# EAGLE design BusBlasterv4.1a (EAGLE 5.07)
LEFT: Normal; OFF: Self-Pwr 1.5~3.3V; ON: Bus-Pwr 3.3V; RIGHT: Update Buffer
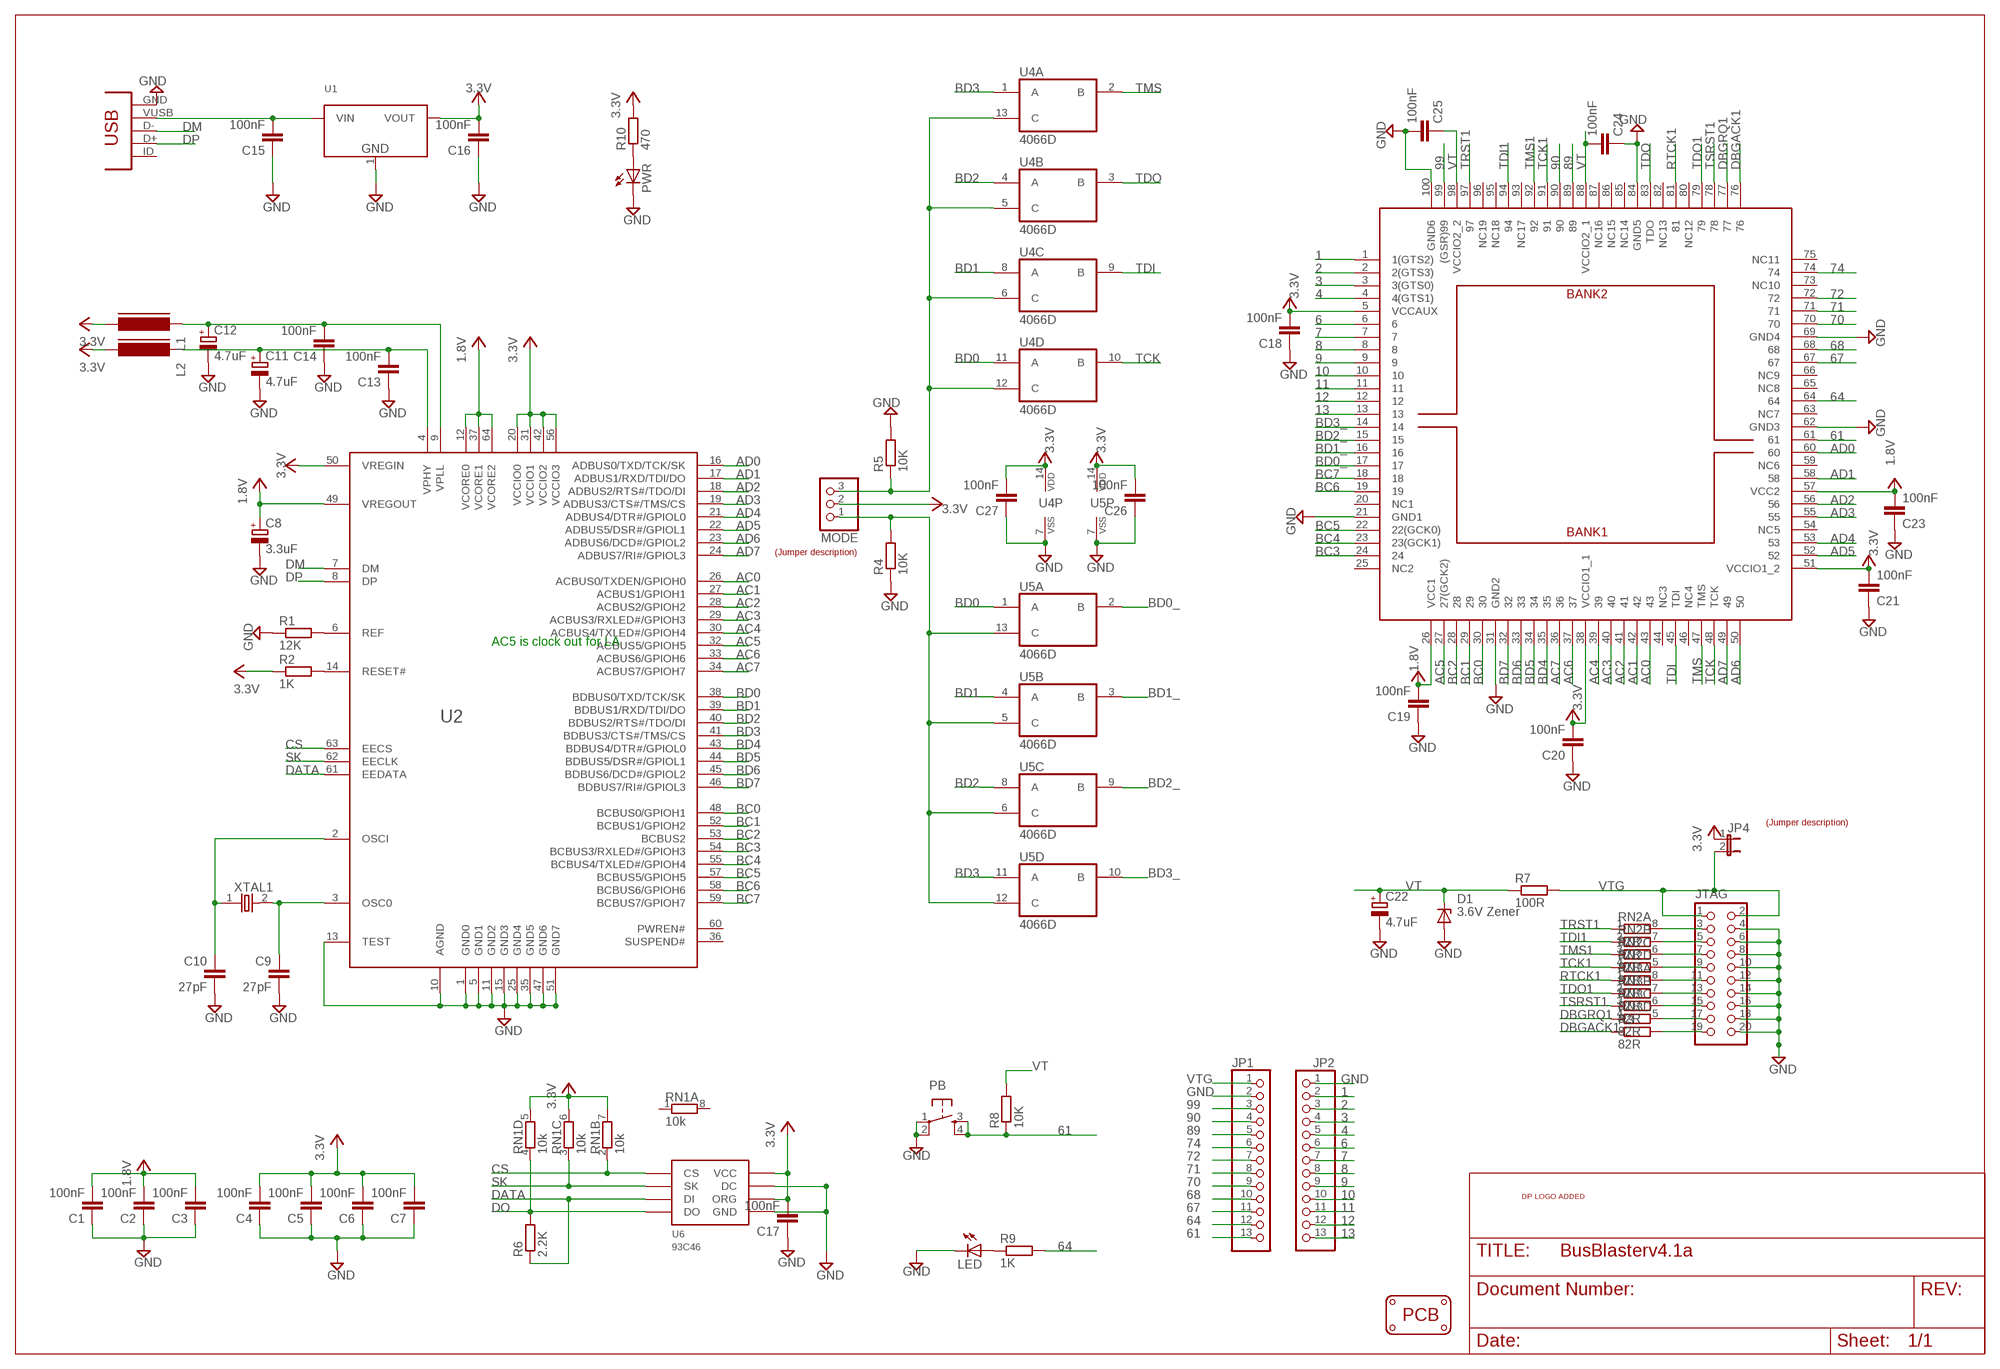
[diagram p0: schematic, sheet 1]

## Parts
C1  100nF  CAPC603  [C603]
C2  100nF  CAPC603  [C603]
C3  100nF  CAPC603  [C603]
C4  100nF  CAPC603  [C603]
C5  100nF  CAPC603  [C603]
C6  100nF  CAPC603  [C603]
C7  100nF  CAPC603  [C603]
C8  3.3uF  CAP_POLSMC_A  [SMC_A]
C9  27pF  CAPC603  [C603]
C10  27pF  CAPC603  [C603]
C11  4.7uF  CAP_POLSMC_A  [SMC_A]
C12  4.7uF  CAP_POLSMC_A  [SMC_A]
C13  100nF  CAPC603  [C603]
C14  100nF  CAPC603  [C603]
C15  100nF  CAPC603  [C603]
C16  100nF  CAPC603  [C603]
C17  100nF  CAPC603  [C603]
C18  100nF  CAPC603  [C603]
C19  100nF  CAPC603  [C603]
C20  100nF  CAPC603  [C603]
C21  100nF  CAPC603  [C603]
C22  4.7uF  CAP_POLSMC_A  [SMC_A]
C23  100nF  CAPC603  [C603]
C24  100nF  CAPC603  [C603]
C25  100nF  CAPC603  [C603]
C26  100nF  CAPC603  [C603]
C27  100nF  CAPC603  [C603]
D1  3.6V Zener  ZENERSOD-123  [SOD-123]
JP1  PINHD-1X13  [1X13]
JP2  PINHD-1X13  [1X13]
JP4  JP1EJP  [1X02]
JTAG  CON_HEADER_2X10-SHROUDED  [PINSHRD_PTH_2X10]
L1  FERRITE_BEAD603  [FB603]
L2  FERRITE_BEAD603  [FB603]
LED  LED805  [LED-805]
MODE  PINHD-1X3  [1X03]
PB  SW-SMD-SMALL  [TACT_SWITCH_SMALL]
PCB1  PCB_DP_RECTANGLE-56X90  [DP9056_V1]
PWR  LEDCHIPLED_0805  [CHIPLED_0805]
R1  12K  RESISTORR603  [R603]
R2  1K  RESISTORR603  [R603]
R3  82R  RESISTORR603  [R603]
R4  10K  RESISTORR603  [R603]
R5  10K  RESISTORR603  [R603]
R6  2.2K  RESISTORR603  [R603]
R7  100R  RESISTORR1206  [R1206]
R8  10K  RESISTORR603  [R603]
R9  1K  RESISTORR603  [R603]
R10  470  RESISTORR603  [R603]
RN1  10k  RNETWORK  [RN8P-4R-CRA06S]
RN2  82R  RNETWORK  [RN8P-4R-CRA06S]
RN3  82R  RNETWORK  [RN8P-4R-CRA06S]
U1  LD1117-3.3SOT223  [SOT223]
U2  FT2232H  [LQFP64@1]
U3  XC2C64A  [VQ100]
U4  4066D  [SO14]
U5  4066D  [SO14]
U6  93C46  [SOIC8]
U$1  DP_LOGO1.5X1.5  [DP_LOGO_ART_1.5X1.5]
U$4  LABEL_JUMPER_1X3  [JUMP3_DESC]
U$7  LABEL_JUMPER_1X2  [JUMP2_DESC]
USB  CON-USB-MINI-BUSB1  [CONN_USB_MINI-B]
XTAL1  OSC-XTAL  [HC-49U]

## Nets
1: JP2.2 U3.1(1(GTS2))
1.8V: C1.2 C2.2 C3.2 C8.+ C19.2 C23.2 U2.12(VCORE0) U2.37(VCORE1) U2.49(VREGOUT) U2.64(VCORE2) U3.26(VCC1) U3.57(VCC2)
2: JP2.3 U3.2(2(GTS3))
3: JP2.4 U3.3(3(GTS0))
4: JP2.5 U3.4(4(GTS1))
6: JP2.6 U3.6
7: JP2.7 U3.7
8: JP2.8 U3.8
9: JP2.9 U3.9
10: JP2.10 U3.10
11: JP2.11 U3.11
12: JP2.12 U3.12
13: JP2.13 U3.13
61: JP1.13 PB.3 PB.4 R8.1 U3.61
64: JP1.12 R9.2 U3.64
67: JP1.11 U3.67
68: JP1.10 U3.68
70: JP1.9 U3.70
71: JP1.8 U3.71
72: JP1.7 U3.72
74: JP1.6 U3.74
89: JP1.5 U3.89
90: JP1.4 U3.90
99: JP1.3 U3.99((GSR)99)
+3V3: C4.2 C5.2 C6.2 C7.2 C16.2 C17.2 C18.2 C20.2 C21.2 C26.2 C27.2 JP4.1 L1.2 L2.2 MODE.2 R2.1 R10.2 RN1.5 RN1.6 RN1.7 U1.2(VOUT) U2.20(VCCIO0) U2.31(VCCIO1) U2.42(VCCIO2) U2.50(VREGIN) U2.56(VCCIO3) U3.5(VCCAUX) U3.38(VCCIO1_1) U3.51(VCCIO1_2) U4.14(P:VDD) U5.14(P:VDD) U6.6(ORG) U6.8(VCC) ; supply symbol labelled 3.3V
AC0: U2.26(ACBUS0/TXDEN/GPIOH0) U3.43
AC1: U2.27(ACBUS1/GPIOH1) U3.42
AC2: U2.28(ACBUS2/GPIOH2) U3.41
AC3: U2.29(ACBUS3/RXLED#/GPIOH3) U3.40
AC4: U2.30(ACBUS4/TXLED#/GPIOH4) U3.39
AC5: U2.32(ACBUS5/GPIOH5) U3.27(27(GCK2))
AC6: U2.33(ACBUS6/GPIOH6) U3.37
AC7: U2.34(ACBUS7/GPIOH7) U3.36
AD0: U2.16(ADBUS0/TXD/TCK/SK) U3.60
AD1: U2.17(ADBUS1/RXD/TDI/DO) U3.58
AD2: U2.18(ADBUS2/RTS#/TDO/DI) U3.56
AD3: U2.19(ADBUS3/CTS#/TMS/CS) U3.55
AD4: U2.21(ADBUS4/DTR#/GPIOL0) U3.53
AD5: U2.22(ADBUS5/DSR#/GPIOL1) U3.52
AD6: U2.23(ADBUS6/DCD#/GPIOL2) U3.50
AD7: U2.24(ADBUS7/RI#/GPIOL3) U3.49
BC0: U2.48(BCBUS0/GPIOH1) U3.30
BC1: U2.52(BCBUS1/GPIOH2) U3.29
BC2: U2.53(BCBUS2) U3.28
BC3: U2.54(BCBUS3/RXLED#/GPIOH3) U3.24
BC4: U2.55(BCBUS4/TXLED#/GPIOH4) U3.23(23(GCK1))
BC5: U2.57(BCBUS5/GPIOH5) U3.22(22(GCK0))
BC6: U2.58(BCBUS6/GPIOH6) U3.19
BC7: U2.59(BCBUS7/GPIOH7) U3.18
BD0: U2.38(BDBUS0/TXD/TCK/SK) U4.11(D:A) U5.1(A:A)
BD0_: U3.17 U5.2(A:B)
BD1: U2.39(BDBUS1/RXD/TDI/DO) U4.8(C:A) U5.4(B:A)
BD1_: U3.16 U5.3(B:B)
BD2: U2.40(BDBUS2/RTS#/TDO/DI) U4.4(B:A) U5.8(C:A)
BD2_: U3.15 U5.9(C:B)
BD3: U2.41(BDBUS3/CTS#/TMS/CS) U4.1(A:A) U5.11(D:A)
BD3_: U3.14 U5.10(D:B)
BD4: U2.43(BDBUS4/DTR#/GPIOL0) U3.35
BD5: U2.44(BDBUS5/DSR#/GPIOL1) U3.34
BD6: U2.45(BDBUS6/DCD#/GPIOL2) U3.33
BD7: U2.46(BDBUS7/RI#/GPIOL3) U3.32
CS: RN1.2 U2.63(EECS) U6.1(CS)
DATA: R6.1 U2.61(EEDATA) U6.3(DI)
DBGACK1: R3.1 U3.76
DBGRQ1: RN3.4 U3.77
DM: U2.7(DM) USB.D-
DO: R6.2 RN1.4 U6.4(DO)
DP: U2.8(DP) USB.D+
GND: C1.1 C2.1 C3.1 C4.1 C5.1 C6.1 C7.1 C8.- C9.2 C10.2 C11.- C12.- C13.1 C14.1 C15.1 C16.1 C17.1 C18.1 C19.1 C20.1 C21.1 C22.- C23.1 C24.1 C25.2 C26.1 C27.1 D1.A JP1.2 JP2.1 JTAG.4 JTAG.6 JTAG.8 JTAG.10 JTAG.12 JTAG.14 JTAG.16 JTAG.18 JTAG.20 LED.C PB.1 PB.2 PWR.C R1.1 R4.1 R5.2 U1.1(GND) U2.1(GND0) U2.5(GND1) U2.10(AGND) U2.11(GND2) U2.13(TEST) U2.15(GND3) U2.25(GND4) U2.35(GND5) U2.47(GND6) U2.51(GND7) U3.21(GND1) U3.31(GND2) U3.62(GND3) U3.69(GND4) U3.84(GND5) U3.100(GND6) U4.7(P:VSS) U5.7(P:VSS) U6.5(GND) U6.7(DC) USB.GND
N$1: C9.1 U2.3(OSC0) XTAL1.2
N$2: C10.1 U2.2(OSCI) XTAL1.1
N$3: R2.2 U2.14(RESET#)
N$4: R1.2 U2.6(REF)
N$5: C15.2 U1.3(VIN) USB.VUSB
N$6: PWR.A R10.1
N$8: LED.A R9.1
N$12: JTAG.3 RN2.8
N$27: JTAG.5 RN2.7
N$28: JTAG.7 RN2.6
N$32: JTAG.9 RN2.5
N$33: JTAG.11 RN3.8
N$38: JTAG.13 RN3.7
N$45: JTAG.15 RN3.6
N$52: JTAG.17 RN3.5
N$64: JTAG.19 R3.2
N$72: MODE.3 R5.1 U4.5(B:C) U4.6(C:C) U4.12(D:C) U4.13(A:C)
N$73: MODE.1 R4.2 U5.5(B:C) U5.6(C:C) U5.12(D:C) U5.13(A:C)
RTCK1: RN3.1 U3.81
SK: RN1.3 U2.62(EECLK) U6.2(SK)
TCK: U3.48(TCK) U4.10(D:B)
TCK1: RN2.4 U3.91
TDI: U3.45(TDI) U4.9(C:B)
TDI1: RN2.2 U3.94
TDO: U3.83(TDO) U4.3(B:B)
TDO1: RN3.2 U3.79
TMS: U3.47(TMS) U4.2(A:B)
TMS1: RN2.3 U3.92
TRST1: RN2.1 U3.97
TSRST1: RN3.3 U3.78
VPHY: C11.+ C13.2 L2.1 U2.4(VPHY)
VPLL: C12.+ C14.2 L1.1 U2.9(VPLL)
VT: C22.+ C24.2 C25.1 D1.C R7.1 R8.2 U3.88(VCCIO2_1) U3.98(VCCIO2_2)
VTG: JP1.1 JP4.2 JTAG.1 JTAG.2 R7.2
Unconnected: RN1.1 RN1.8 U2.36(SUSPEND#) U2.60(PWREN#) U3.20(NC1) U3.25(NC2) U3.44(NC3) U3.46(NC4) U3.54(NC5) U3.59(NC6) U3.63(NC7) U3.65(NC8) U3.66(NC9) U3.73(NC10) U3.75(NC11) U3.80(NC12) U3.82(NC13) U3.85(NC14) U3.86(NC15) U3.87(NC16) U3.93(NC17) U3.95(NC18) U3.96(NC19) USB.BODY@1(BODY) USB.BODY@2(BODY) USB.BODY@3(BODY) USB.BODY@4(BODY) USB.ID(USBID)

## Notes on the sheet
- AC5 is clock out for LA

## Library data of the parts
C1-C7 C9 C10 C13-C21 C23-C27 = dp_devices:CAP
C8 C11 C12 C22 = DP-EagleLibrary:CAP_POL
D1 = dp_devices:ZENER: Zener Diode SOD-323
JP1 JP2 = pinhead:PINHD-1X13: PIN HEADER
JP4 = jumper:JP1E: JUMPER
JTAG = dp_devices:CON_HEADER_2X10
L1 L2 = dp_devices:FERRITE_BEAD
LED = dp_devices:LED
MODE = pinhead:PINHD-1X3: PIN HEADER
PB = dp_devices:SW-SMD-SMALL
PCB1 = dp_devices:PCB_DP_RECTANGLE: Dangerous Prototypes Standard Rectangular PCB sizes
PWR = led:LED: LED OSRAM: - CHIPLED LG R971, LG N971, LY N971, LG Q971, LY Q971, LO R971, LY R971 LH N974, LH R974 LS Q976, LO Q976, LY Q976 LO Q996 - Hyper CHIPLED LW Q18S LB Q993, LB Q99A, LB R99A - SideLED LS A670, LO A670, LY A670, LG A670, LP A670 LB A673, LV A673, LT A673, LW A673 LH A674 LY A675 LS A676, LA A676, LO A676, LY A676, LW A676 LS A679, LY A679, LG A679 - Hyper Micro SIDELED® LS Y876, LA Y876, LO Y876, LY Y876 LT Y87S - SmartLED LW L88C, LW L88S LB L89C, LB L89S, LG L890 LS L89K, LO L89K, LY L89K LS L896, LA L896, LO L896, LY L896 - TOPLED LS T670, LO T670, LY T670, LG T670, LP T670 LSG T670, LSP T670, LSY T670, LOP T670, LYG T670 LG T671, LOG T671, LSG T671 LB T673, LV T673, LT T673, LW T673 LH T674 LS T676, LA T676, LO T676, LY T676, LB T676, LH T676, LSB T676, LW T676 LB T67C, LV T67C, LT T67C, LS T67K, LO T67K, LY T67K, LW E67C LS E67B, LA E67B, LO E67B, LY E67B, LB E67C, LV E67C, LT E67C LW T67C LS T679, LY T679, LG T679 LS T770, LO T770, LY T770, LG T770, LP T770 LB T773, LV T773, LT T773, LW T773 LH T774 LS E675, LA E675, LY E675, LS T675 LS T776, LA T776, LO T776, LY T776, LB T776 LHGB T686 LT T68C, LB T68C - Hyper Mini TOPLED® LB M676 - Mini TOPLED Santana® LG M470 LS M47K, LO M47K, LY M47K Source: http://www.osram.convergy.de LUXEON: - LUMILED® LXK2-PW12-R00, LXK2-PW12-S00, LXK2-PW14-U00, LXK2-PW14-V00 LXK2-PM12-R00, LXK2-PM12-S00, LXK2-PM14-U00 LXK2-PE12-Q00, LXK2-PE12-R00, LXK2-PE12-S00, LXK2-PE14-T00, LXK2-PE14-U00 LXK2-PB12-K00, LXK2-PB12-L00, LXK2-PB12-M00, LXK2-PB14-N00, LXK2-PB14-P00, LXK2-PB14-Q00 LXK2-PR12-L00, LXK2-PR12-M00, LXK2-PR14-Q00, LXK2-PR14-R00 LXK2-PD12-Q00, LXK2-PD12-R00, LXK2-PD12-S00 LXK2-PH12-R00, LXK2-PH12-S00 LXK2-PL12-P00, LXK2-PL12-Q00, LXK2-PL12-R00 Source: www.luxeon.com KINGBRIGHT: KA-3528ASYC Source: www.kingbright.com
R1-R10 = dp_devices:RESISTOR
RN1-RN3 = dp_devices:RNETWORK: 4 Resistor Array 0603
U1 = dp_devices:LD1117-3.3
U2 = dp_devices:FT2232H: DUAL HIGH SPEED USB TO MULTIPURPOSE UART/FIFO IC
U3 = fpga:XC2C64A
U4 U5 = 40xx:4066: Quad bilateral ANALOG SWITCH
U6 = DP-EagleLibrary:93C46
U$1 = dp_devices:DP_LOGO
U$4 = dp_devices:LABEL_JUMPER_1X3: Nice formatted three legged jumperdescription Use attributes to change the values LEFT = With jumper to the left RIGHT = With jumper to the right; LEFT: left; RIGHT: right
U$7 = dp_devices:LABEL_JUMPER_1X2: Nice formatted two legged jumperdescription Use attributes to change the values ON = With jumper OFF = Without jumper; OFF: off; ON: on
USB = dp_devices:CON-USB-MINI-B: USB connector
XTAL1 = dp_devices:OSC-XTAL

## Board
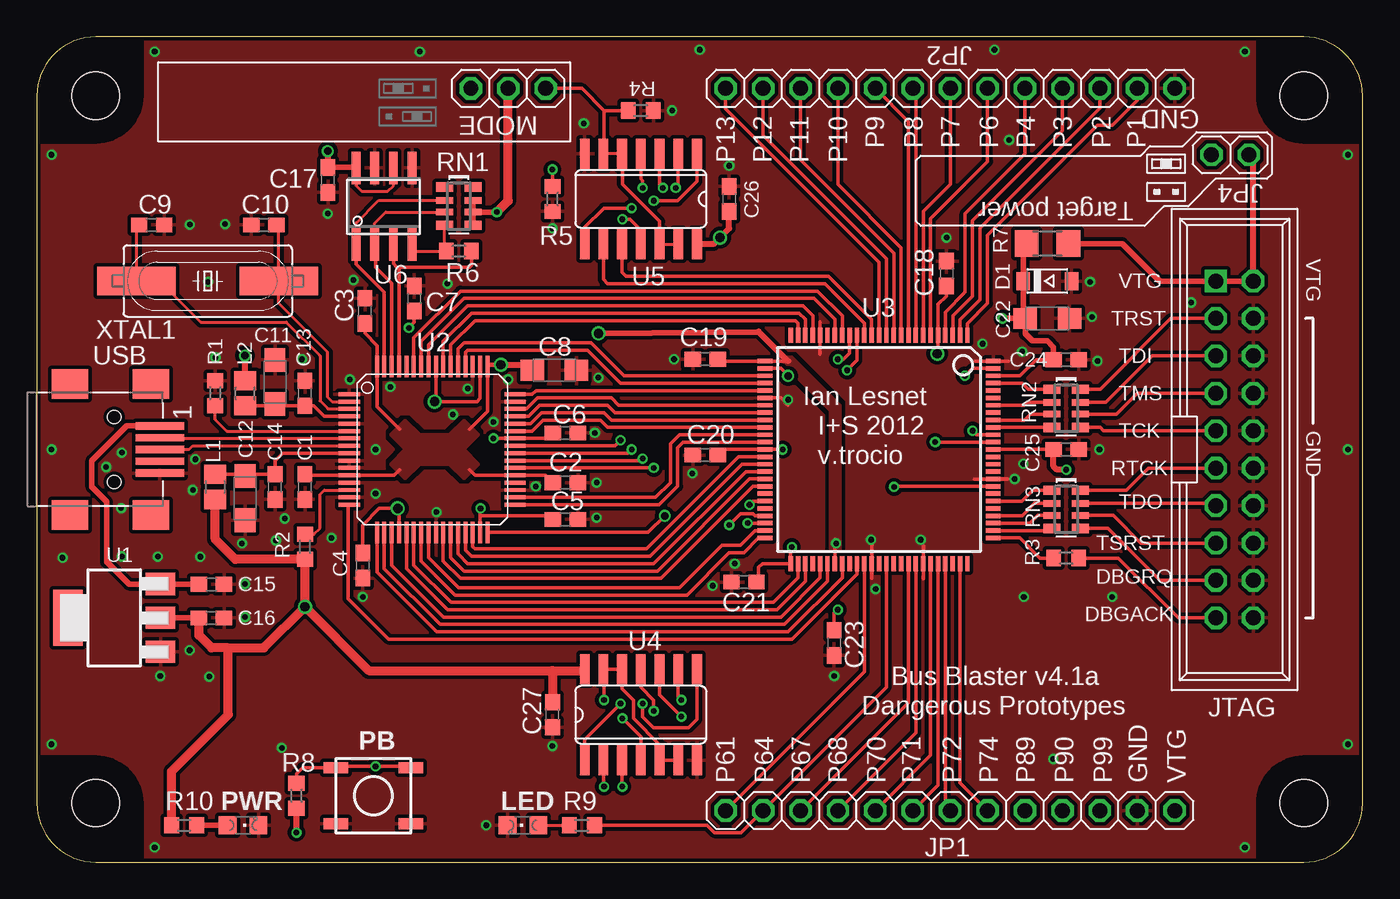
[diagram p1: board, top side]
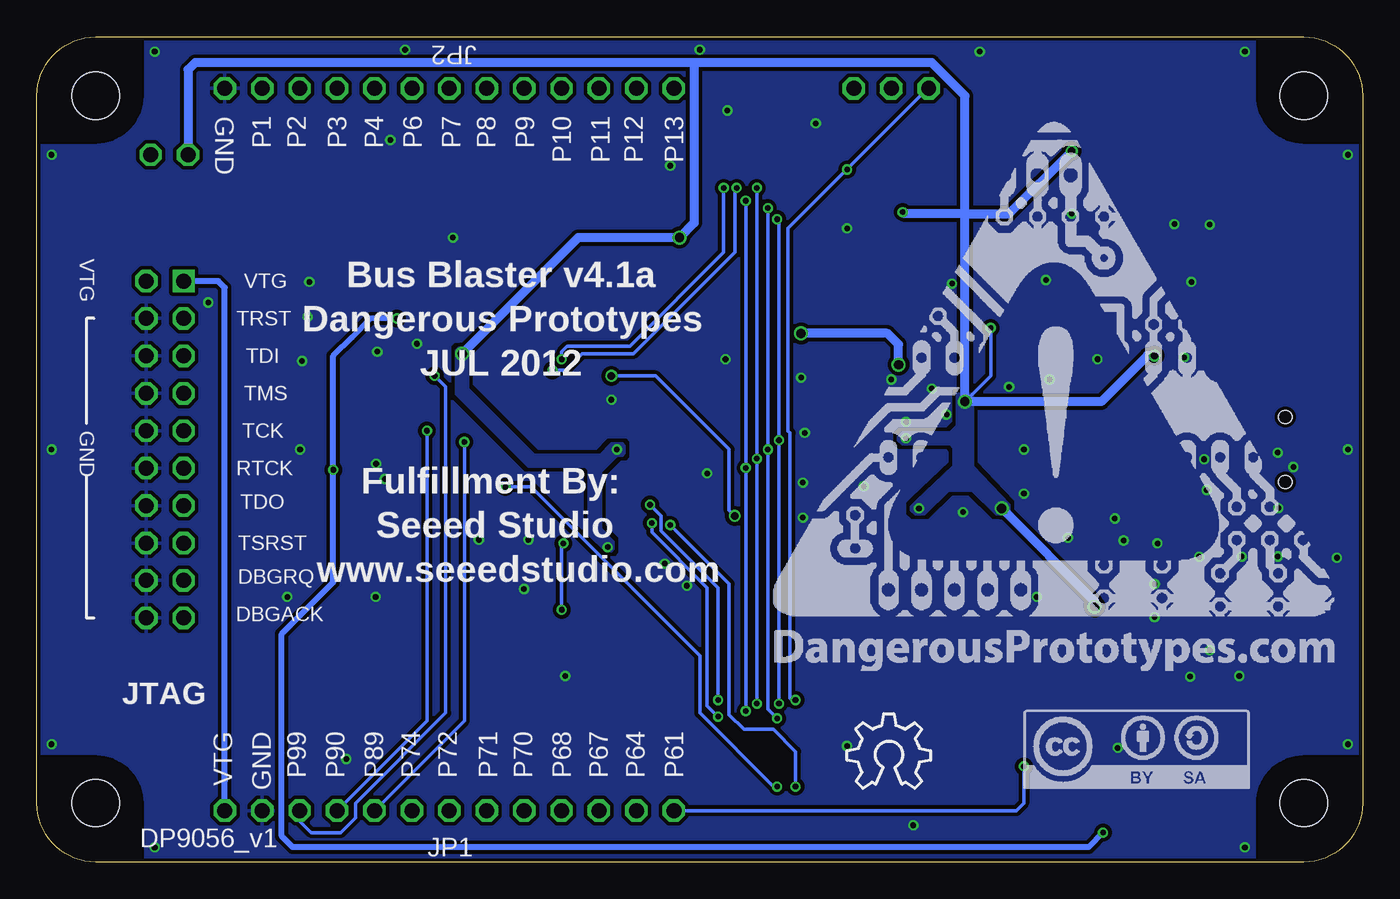
[diagram p2: board, bottom side, seen from below]

Size 90 x 56 mm. Coordinates in mm from the lower left corner, seen from the top.
Copper layers (1*16): Top 0.035mm / dielectric 1.5mm / Bottom 0.035mm
Design rules "Fusion_eagle_rule_v1.1": minimum track width 6mil, minimum drill 12mil, track to track 6mil, track to pad 6mil, pad to pad 6mil, via to via 6mil, smd to smd 0mil, copper to edge 10mil, drill to drill 10mil, minimum pad ring 10mil, minimum via ring 6mil, stop-mask expansion 2mil, vias tented up to drill 100mil, thermal gap 10mil

### Footprints (pad centres in the part's own frame; a part is rotated, then mirrored left to right if it is on the bottom)
C603 = smd 1.1 x 1: 1 -0.85,0; 2 0.85,0
SMC_A = smd 1.6 x 1.4: + -1.5,0; - 1.5,0
SOD-123 = smd 0.91 x 1.22: A 1.635,0; C -1.635,0
1X13 = drill 1.016 octagon: 1 -15.24,0; 2 -12.7,0; 3 -10.16,0; 4 -7.62,0; 5 -5.08,0; 6 -2.54,0; 7 0,0; 8 2.54,0; 9 5.08,0; 10 7.62,0; 11 10.16,0; 12 12.7,0; 13 15.24,0
1X02 = drill 1.016 octagon: 1 -1.27,0; 2 1.27,0
PINSHRD_PTH_2X10 = drill 1.016 square: 1 -11.43,-1.27 | drill 1.016 octagon: 2 -11.43,1.27; 3 -8.89,-1.27; 4 -8.89,1.27; 5 -6.35,-1.27; 6 -6.35,1.27; 7 -3.81,-1.27; 8 -3.81,1.27; 9 -1.27,-1.27; 10 -1.27,1.27; 11 1.27,-1.27; 12 1.27,1.27; 13 3.81,-1.27; 14 3.81,1.27; 15 6.35,-1.27; 16 6.35,1.27; 17 8.89,-1.27; 18 8.89,1.27; 19 11.43,-1.27; 20 11.43,1.27
FB603 = smd 1.3 x 1.5: 1 -0.85,0; 2 0.85,0
LED-805 = smd 1.2 x 1.2: A 0,-1.05; C 0,1.05
1X03 = drill 1.016 octagon: 1 -2.54,0; 2 0,0; 3 2.54,0
TACT_SWITCH_SMALL = smd 1.651 x 0.762: 1 -2.54,1.905; 2 2.54,1.905; 3 -2.54,-1.905; 4 2.54,-1.905
DP9056_V1 = hole 3.2: 4,4; 86,4; 86,52; 4,52
CHIPLED_0805 = smd 1.2 x 1.2: A 0,-1.05; C 0,1.05
R603 = smd 1 x 1.1: 1 -0.85,0; 2 0.85,0
R1206 = smd 1.6 x 1.803: 1 -1.422,0; 2 1.422,0
RN8P-4R-CRA06S = smd 0.63 x 1.15: 1 -1.295,-0.975; 4 1.295,-0.975; 5 1.295,0.975; 8 -1.295,0.975 | smd 0.44 x 1.15: 2 -0.4,-0.975; 3 0.4,-0.975; 6 0.4,0.975; 7 -0.4,0.975
SOT223 = smd 1.5 x 2: 1 -2.3,-3.15; 2 0,-3.15; 3 2.3,-3.15 | smd 3.8 x 2: 4 0,3.15
LQFP64@1 = smd 1.45 x 0.27: 1 -5.625,3.75; 2 -5.625,3.25; 3 -5.625,2.75; 4 -5.625,2.25; 5 -5.625,1.75; 6 -5.625,1.25; 7 -5.625,0.75; 8 -5.625,0.25; 9 -5.625,-0.25; 10 -5.625,-0.75; 11 -5.625,-1.25; 12 -5.625,-1.75; 13 -5.625,-2.25; 14 -5.625,-2.75; 15 -5.625,-3.25; 16 -5.625,-3.75; 33 5.625,-3.75; 34 5.625,-3.25; 35 5.625,-2.75; 36 5.625,-2.25; 37 5.625,-1.75; 38 5.625,-1.25; 39 5.625,-0.75; 40 5.625,-0.25; 41 5.625,0.25; 42 5.625,0.75; 43 5.625,1.25; 44 5.625,1.75; 45 5.625,2.25; 46 5.625,2.75; 47 5.625,3.25; 48 5.625,3.75 | smd 0.27 x 1.45: 17 -3.75,-5.625; 18 -3.25,-5.625; 19 -2.75,-5.625; 20 -2.25,-5.625; 21 -1.75,-5.625; 22 -1.25,-5.625; 23 -0.75,-5.625; 24 -0.25,-5.625; 25 0.25,-5.625; 26 0.75,-5.625; 27 1.25,-5.625; 28 1.75,-5.625; 29 2.25,-5.625; 30 2.75,-5.625; 31 3.25,-5.625; 32 3.75,-5.625; 49 3.75,5.625; 50 3.25,5.625; 51 2.75,5.625; 52 2.25,5.625; 53 1.75,5.625; 54 1.25,5.625; 55 0.75,5.625; 56 0.25,5.625; 57 -0.25,5.625; 58 -0.75,5.625; 59 -1.25,5.625; 60 -1.75,5.625; 61 -2.25,5.625; 62 -2.75,5.625; 63 -3.25,5.625; 64 -3.75,5.625
VQ100 = smd 1 x 0.3: 1 -7.75,6; 2 -7.75,5.5; 3 -7.75,5; 4 -7.75,4.5; 5 -7.75,4; 6 -7.75,3.5; 7 -7.75,3; 8 -7.75,2.5; 9 -7.75,2; 10 -7.75,1.5; 11 -7.75,1; 12 -7.75,0.5; 13 -7.75,0; 14 -7.75,-0.5; 15 -7.75,-1; 16 -7.75,-1.5; 17 -7.75,-2; 18 -7.75,-2.5; 19 -7.75,-3; 20 -7.75,-3.5; 21 -7.75,-4; 22 -7.75,-4.5; 23 -7.75,-5; 24 -7.75,-5.5; 25 -7.75,-6; 51 7.75,-6; 52 7.75,-5.5; 53 7.75,-5; 54 7.75,-4.5; 55 7.75,-4; 56 7.75,-3.5; 57 7.75,-3; 58 7.75,-2.5; 59 7.75,-2; 60 7.75,-1.5; 61 7.75,-1; 62 7.75,-0.5; 63 7.75,0; 64 7.75,0.5; 65 7.75,1; 66 7.75,1.5; 67 7.75,2; 68 7.75,2.5; 69 7.75,3; 70 7.75,3.5; 71 7.75,4; 72 7.75,4.5; 73 7.75,5; 74 7.75,5.5; 75 7.75,6 | smd 0.3 x 1: 26 -6,-7.75; 27 -5.5,-7.75; 28 -5,-7.75; 29 -4.5,-7.75; 30 -4,-7.75; 31 -3.5,-7.75; 32 -3,-7.75; 33 -2.5,-7.75; 34 -2,-7.75; 35 -1.5,-7.75; 36 -1,-7.75; 37 -0.5,-7.75; 38 0,-7.75; 39 0.5,-7.75; 40 1,-7.75; 41 1.5,-7.75; 42 2,-7.75; 43 2.5,-7.75; 44 3,-7.75; 45 3.5,-7.75; 46 4,-7.75; 47 4.5,-7.75; 48 5,-7.75; 49 5.5,-7.75; 50 6,-7.75; 76 6,7.75; 77 5.5,7.75; 78 5,7.75; 79 4.5,7.75; 80 4,7.75; 81 3.5,7.75; 82 3,7.75; 83 2.5,7.75; 84 2,7.75; 85 1.5,7.75; 86 1,7.75; 87 0.5,7.75; 88 0,7.75; 89 -0.5,7.75; 90 -1,7.75; 91 -1.5,7.75; 92 -2,7.75; 93 -2.5,7.75; 94 -3,7.75; 95 -3.5,7.75; 96 -4,7.75; 97 -4.5,7.75; 98 -5,7.75; 99 -5.5,7.75; 100 -6,7.75
SO14 = smd 0.66 x 2.032: 1 -3.81,-3.073; 2 -2.54,-3.073; 3 -1.27,-3.073; 4 0,-3.073; 5 1.27,-3.073; 6 2.54,-3.073; 7 3.81,-3.073; 8 3.81,3.073; 9 2.54,3.073; 10 1.27,3.073; 11 0,3.073; 12 -1.27,3.073; 13 -2.54,3.073; 14 -3.81,3.073
SOIC8 = smd 0.6 x 2.2: 1 -1.905,-2.6; 2 -0.635,-2.6; 3 0.635,-2.6; 4 1.905,-2.6; 5 1.905,2.6; 6 0.635,2.6; 7 -0.635,2.6; 8 -1.905,2.6
CONN_USB_MINI-B = smd 2 x 2.5: BODY@1 -4.45,2.5; BODY@2 4.45,2.5; BODY@3 4.45,-3; BODY@4 -4.45,-3 | smd 0.5 x 3.3: D+ 0,3.1; D- -0.8,3.1; GND 1.6,3.1; ID 0.8,3.1; VUSB -1.6,3.1 | hole 0.9: -2.2,0; 2.2,0
HC-49U = smd 5.334 x 1.93: 1 -4.826,0; 2 4.826,0

### Placement (x,y rotation side)
C1  18.2,25.46 90 top
C2  35.88,25.75 180 top
C3  22.27,37.4 270 top
C4  22.12,20.12 90 top
C5  35.88,23.25 180 top
C6  35.88,29.12 180 top
C7  25.62,38.25 270 top
C8  35.12,33.38 0 top
C9  7.79,43.24 0 top
C10  15.41,43.24 180 top
C11  16.17,32.57 90 top
C12  14.14,24.7 270 top
C13  18.2,31.81 270 top
C14  16.17,25.46 90 top
C15  11.85,18.86 180 top
C16  11.85,16.57 180 top
C17  19.76,46.29 90 top
C18  61.74,39.94 270 top
C19  45.38,34.12 0 top
C20  45.38,27.62 0 top
C21  48,19 0 top
C22  68.6,36.89 0 top
C23  54.12,14.88 90 top
C24  69.87,34.1 180 top
C25  69.87,28 0 top
C26  47,45 270 top
C27  35,10 90 top
D1  68.6,39.43 0 top
JP1  62,3.5 180 top
JP2  62,52.5 180 top
JP4  81,48 0 top
JTAG  81.3,28 270 top
L1  12.11,25.46 270 top
L2  14.14,31.81 90 top
LED  33,2.5 90 top
MODE  32,52.5 180 top
PB  22.84,4.5 180 top
PCB1  0,0 0 top
PWR  14,2.5 270 top
R1  12.11,31.81 270 top
R2  18.2,21.4 90 top
R3  69.87,20.63 0 top
R4  41,51 180 top
R5  35,45 270 top
R6  28.65,41.46 180 top
R7  68.6,41.97 0 top
R8  17.62,4.5 270 top
R9  37,2.5 0 top
R10  10,2.5 180 top
RN1  28.65,44.51 270 top
RN2  69.87,30.79 270 top
RN3  69.87,23.94 270 top
U1  5.25,16.57 90 top
U2  26.84,28 0 top
U3  57.17,28 270 top
U4  41,10 0 top
U5  41,45 180 top
U6  23.57,44.51 0 top
U$1  40,13 0 bottom
U$2  [CC-BY-SA]  23,5 0 bottom
U$3  [OSHW_8X200_NOTEXT]  35,5 0 bottom
U$4  22,51.87 180 top
U$7  74.12,46.75 180 top
USB  5.25,28 270 top
XTAL1  11.6,39.43 180 top

### Tracks (layer width: path | path; a pad name or v marks a point on that pad's centre or on a via)
1
  Top 0.254: U3.1 63.17,36.54 64.54,37.91 64.54,42.54 72,50 73,50 74.7,51.7 JP2.2
1.8V  (via drill 0.38, 0.64)
  Top 0.254: C1.2 18.26,26.25 U2.12 24.25,26.25 24.62,26.62 | C3.2 22.27,35.87 23.09,35.05 U2.64 23.09,30.91 24.62,29.38 | 51.05,34 51,34 U3.26 46.35,34 C19.2 | U2.49 30.59,33.41 | C23.2 54.12,16.88 v54.38,17.12 | U3.57 54.17,21.92 v54.25,21.62 | U2.49 30.59,30.59 29.38,29.38 | 29.38,26.62 29.75,26.25 U2.37 34.52,26.25 C2.2 | U2.49 30.59,33.72 30.62,33.75
  Top 0.305: 30.62,33.75 v31.5,33.75
  Top 0.406: v31.5,33.75 33.62,33.75 C8.+ | v38.12,35.88 49,36 51,34
  Bottom 0.254: v54.38,17.12 54.38,21.5 v54.25,21.62
  Bottom 0.61: v31.5,33.75 31.5,35.12 32.25,35.88 v38.12,35.88
  pour Top: 24,29 25,30 26,29 28,29 29,30 30,29 29,28 30,27 29,26 28,27 26,27 25,26 24,27 25,28
  pour Top (isolate 0.254): 50.25,34.12 50.38,34.25 51.25,34.25 54.5,31 54.5,21.25 54.38,21.12 54,21.12 53.88,21.25 53.88,30.62 50.88,33.62 50.38,33.62 50.25,33.75
2
  Top 0.254: U3.2 62.67,36.8 64.03,38.16 64,38.19 64,43 72.16,51.16 JP2.3
3
  Top 0.254: U3.3 62.17,37.06 63.52,38.41 63.52,43.52 69.62,49.62 JP2.4
4
  Top 0.254: U3.4 61.67,37.33 63.01,38.67 63.01,43.29 63.01,43.99 63,44 67.08,48.08 JP2.5
6
  Top 0.254: U3.6 60.67,43.09 60.67,43.67 64.54,47.54 JP2.6
7
  Top 0.254: U3.7 60.17,41.05 60.17,44.17 62,46 JP2.7
8
  Top 0.254: U3.8 59.67,42.01 59.67,52.29 JP2.8
9
  Top 0.254: U3.9 59.17,41.75 59.17,50.25 JP2.9
10
  Top 0.254: U3.10 58.67,41.7 54.38,45.99 JP2.10
11
  Top 0.254: U3.11 58.17,41.33 51.84,47.66 JP2.11
12
  Top 0.254: U3.12 57.67,40.95 49.3,49.33 JP2.12
13
  Top 0.254: U3.13 57.17,40.7 46.76,51.12 JP2.13
61  (via drill 0.38)
  Top 0.254: U3.61 56.17,12.91 JP1.13 | PB.3 25.38,6.5 v23,6.5 20.39,6.5 PB.4 18.03,6.41 17.62,6 R8.1
  Bottom 0.254: JP1.13 23.5,3.5 23,4 v23,6.5
64
  Top 0.254: U3.64 57.67,11.87 JP1.12 47.8,2 46,2 45.5,2.5 R9.2
67
  Top 0.254: U3.67 59.17,10.83 JP1.11
68
  Top 0.254: U3.68 59.67,8.79 JP1.10
70
  Top 0.254: U3.70 60.67,7.25 JP1.9
71
  Top 0.254: U3.71 61.17,5.21 JP1.8
72
  Top 0.254: U3.72 61.67,3.83 JP1.7
74
  Top 0.254: U3.74 62.67,5.37 JP1.6
89  (via drill 0.38)
  Top 0.203: v60.98,28.51 v60.99,28.5
  Top 0.254: v60.99,28.5 U3.89
  Bottom 0.254: v60.98,28.51 60.98,9.6 JP1.5
90  (via drill 0.38)
  Top 0.254: U3.90 63.79,29 v63.52,29.27
  Bottom 0.254: v63.52,29.27 63.52,9.6 JP1.4
99  (via drill 0.38)
  Top 0.254: U3.99 63.5,33.5 v63,33
  Bottom 0.254: v63,33 62.25,32.25 62.25,10.12 68.38,4 68.38,3 69.38,2 71.38,2 72.16,2.79 JP1.3
+3V3  (via drill 0.38, 0.51, 0.64)
  Top 0.203: U6.6 24.2,45.91 23.82,45.53 22.05,45.53 21.66,45.91 U6.8
  Top 0.254: C18.2 61.74,38.41 61.17,37.84 U3.5 61.17,34.55 v61.12,34.5 | C6.2 35.02,28.75 U2.42 v31,28.75 | C20.2 46.6,28 U3.38 v50.62,28 | C5.2 35.02,23.5 30.09,23.5 | C4.2 22.12,22.88 23.25,24 v24.5,24 24.59,23.91 U2.20 | U2.56 27.09,31.34 v27,31.25 29.88,31.25 30.09,31.46 U2.50 | C7.2 25.62,36.62 v25.25,36.25 | U2.31 30.09,23.5 | 30.09,23.5 30.09,23.96 v30.12,24 | v51.25,21.38 51.17,21.3 U3.51 49.25,20.25 49,20 49,19.15 C21.2
  Top 0.381: C16.2 U1.2 | RN1.6 RN1.7 | RN1.6 RN1.5 | U6.8 21.64,47.14 C17.2 19.67,47.05 | v31.22,44.11 RN1.6
  Top 0.406: U5.14 45.93,41.93 v46.38,42.38 47,43 C26.2 | 37.12,13 U4.14 | v19.75,48.25 C17.2 | v14.12,34.38 14.12,32.67 L2.2 | v31.22,44.11 31.23,44.11 31.25,44.12
  Top 0.61: C16.2 11,15.39 11.85,14.54 13,14.54 | v18.2,17.33 R2.1 13.47,20.55 12.11,21.9 L1.2 | 13,14.54 15.41,14.54 v18.2,17.33 | 35,13 22.54,13 v18.2,17.33 | 35,13 37.12,13 | 35,13 C27.2 | MODE.2 32,44.88 31.25,44.12 | R10.2 9.15,6.15 13,10 13,14.54
  Bottom 0.254: v25.25,36.25 25.25,33 v27,31.25
  Bottom 0.406: 31.11,44 v31.22,44.11
  Bottom 0.61: v18.2,17.33 18.2,17.7 v24.5,24 | 27,44 v27,31.25 17.75,31.25 14.62,34.38 v14.12,34.38 | 27,44 24,44 v19.75,48.25 | 27,44 31.11,44 | JP4.1 79.73,53.77 79.25,54.25 45.38,54.25 | 45.38,54.25 29.25,54.25 27,52 27,44 | 45.38,54.25 45.38,43.38 v46.38,42.38 53.25,42.38 v61.12,34.5
  pour Bottom (isolate 0.254): 26.5,31.75 27.5,31.75 27.5,29.62 28,29.12 31.25,29.12 31.5,28.88 31.5,28.62 31.25,28.38 28,28.38 27.75,28.12 27.75,26.88 30.25,24.5 30.62,24.12 30.62,23.88 30.38,23.62 29.75,23.62 28.12,25.25 26.5,25.25 24.88,23.62 24.25,23.62 24,23.88 24,24.25 26.5,26.88
  pour Bottom (isolate 0.254): 60.88,34.88 61.38,34.88 61.5,34.75 61.5,31.75 56.62,26.88 52.75,26.88 52.5,26.62 52.5,22.25 51.38,21.12 51,21.12 50.88,21.25 50.88,21.75 51.75,22.62 51.75,26.5 50.62,27.62 50.25,27.62 50.12,27.75 50.12,28.25 50.25,28.38 51,28.38 51.75,27.62 56.25,27.62 60.75,32.12 60.75,34.75
AC0
  Top 0.254: U3.43 48.62,25.5 42.38,19.25 28.75,19.25 27.59,20.41 U2.26
AC1
  Top 0.254: U3.42 48.38,26 42.12,19.75 29,19.75 28.09,20.66 U2.27
AC2
  Top 0.254: U3.41 48.12,26.5 41.88,20.25 29.25,20.25 28.59,20.91 U2.28
AC3
  Top 0.254: U3.40 47.88,27 41.62,20.75 29.5,20.75 29.09,21.16 U2.29
AC4
  Top 0.254: U3.39 47.62,27.5 41.38,21.25 29.75,21.25 29.59,21.41 U2.30
AC5  (via drill 0.51)
  Top 0.254: U3.27 50.5,33.5 v51,33 | U2.32 41.5,22.38 v42.62,23.5
  Bottom 0.254: v42.62,23.5 43,23.88 43,28 48,33 v51,33
AC6
  Top 0.254: U3.37 43.88,28.5 43.5,28.12 43.5,25.5 42.25,24.25 U2.33
AC7
  Top 0.254: U3.36 43.62,29 43,28.38 43,25.75 42,24.75 U2.34
AD0
  Top 0.254: U3.60 55.67,19.55 51.25,15.12 23.88,15.12 21.12,17.88 21.12,24.25 U2.16
AD1
  Top 0.254: U2.17 23.09,19.66 27.12,15.62 51,15.62 54.67,19.3 U3.58
AD2
  Top 0.254: U2.18 23.59,19.91 27.38,16.12 50.75,16.12 53.67,19.05 U3.56
AD3
  Top 0.254: U2.19 24.09,20.16 27.62,16.62 50.5,16.62 53.17,19.3 U3.55
AD4
  Top 0.254: U2.21 25.09,19.91 27.88,17.12 50.25,17.12 52.17,19.05 U3.53
AD5
  Top 0.254: U2.22 25.59,20.16 28.12,17.62 50,17.62 51.67,19.3 U3.52
AD6
  Top 0.254: U2.23 26.09,20.41 28.38,18.12 44.12,18.12 47,21 48,21 49,22 U3.50
AD7
  Top 0.254: U2.24 26.59,20.66 28.62,18.62 43.62,18.62 46.5,21.5 47.75,21.5 48.75,22.5 U3.49
BC0
  Top 0.254: U3.30 33.88,32 33.62,31.75 U2.48
BC1
  Top 0.254: U2.52 29.09,34.59 29.25,34.75 37.38,34.75 39.62,32.5 U3.29
BC2
  Top 0.254: U2.53 28.59,34.84 29,35.25 37.62,35.25 39.88,33 U3.28
BC3
  Top 0.254: U3.24 51.67,36.58 51.5,36.75 29.75,36.75 28.09,35.09 U2.54
BC4
  Top 0.254: U3.23 52.17,36.83 51.75,37.25 29.5,37.25 27.59,35.34 U2.55
BC5
  Top 0.254: U2.57 26.59,35.09 29.25,37.75 52,37.75 52.67,37.08 U3.22
BC6
  Top 0.254: U2.58 26.09,35.34 29,38.25 52.75,38.25 54.17,36.83 U3.19
BC7
  Top 0.254: U2.59 25.59,35.59 28.75,38.75 53,38.75 54.67,37.08 U3.18
BD0  (via drill 0.38)
  Top 0.254: v41.88,26.75 U2.38 | v41.88,44.88 43.5,44.88 44.81,46.19 U5.1 | U4.11 41,11.88 41.88,11 v41.88,10.25
  Bottom 0.254: v41.88,10.25 v41.88,26.75 v41.88,44.88
BD0_  (via drill 0.38)
  Top 0.254: U5.2 43.54,45.91 v43.38,45.75 | v54.38,34.12 54.75,34.12 55.17,34.55 U3.17
  Bottom 0.254: v43.38,45.75 43.38,41.38 49.75,35 54,35 54.38,34.62 v54.38,34.12
BD1  (via drill 0.38)
  Top 0.254: U2.39 41,27.25 v41.12,27.38 | U5.4 41,46.38 41.12,46.25 v41.12,45.75 | v41.12,10.75 41.12,9.88 41.88,9.12 44.25,9.12 44.81,9.69 U4.8
  Bottom 0.254: v41.12,10.75 v41.12,27.38 v41.12,45.75
BD1_  (via drill 0.38)
  Top 0.254: U5.3 42.27,45.98 v42.5,45.75 | U3.16 55.67,34.05 v55,33.38
  Bottom 0.254: v42.5,45.75 42.62,45.62 42.62,41.38 49.5,34.5 53,34.5 54.12,33.38 v55,33.38
BD2  (via drill 0.38)
  Top 0.254: U2.40 40.12,27.75 v40.38,28 | v40.38,44.38 38.5,44.38 37.19,43.06 U5.8 | v39.75,9.75 41,8.5 U4.4
  Bottom 0.254: v39.75,9.75 40.38,10.38 v40.38,28 v40.38,44.38
BD2_
  Top 0.254: U3.15 56.17,36.58 53.5,39.25 38.75,39.25 38.46,39.54 U5.9
BD3  (via drill 0.38)
  Top 0.254: U2.41 39.25,28.25 v39.62,28.62 | v39.75,43.62 40.25,43.62 41,42.88 U5.11 | U4.1 37.19,8.31 v39.62,10.75
  Bottom 0.254: v39.75,43.62 39.62,43.5 v39.62,28.62 v39.62,10.75
BD3_
  Top 0.254: U3.14 56.67,36.83 53.75,39.75 40,39.75 39.73,40.02 U5.10
BD4
  Top 0.254: U3.35 38.75,29.5 38.25,30 34.38,30 33.62,29.25 U2.43
BD5
  Top 0.254: U2.44 33.5,29.75 34.25,30.5 38.5,30.5 39,30 U3.34
BD6
  Top 0.254: U3.33 39.25,30.5 38.75,31 34.12,31 33.38,30.25 U2.45
BD7
  Top 0.254: U2.46 33.25,30.75 34,31.5 39,31.5 39.5,31 U3.32
CS
  Top 0.203: U6.1 21.66,43.37 23.21,44.91 RN1.2
  Top 0.254: U2.63 23.59,38.66 21.66,40.59 U6.1
DATA
  Top 0.254: R6.1 29.5,40.5 29.38,40.38 24.62,40.38 | U2.61 24.59,40.34 24.62,40.38 | U6.3 24.2,40.6 24.43,40.38 24.62,40.38
DBGACK1
  Top 0.254: U3.76 66.73,22 68.09,20.63 R3.1
DBGRQ1
  Top 0.203: 68.75,22.5 RN3.4
  Top 0.254: U3.77 68.75,22.5
DM
  Top 0.203: U2.7 8.4,28.75 USB.D-
DO
  Top 0.203: RN1.4 27.68,41.59 R6.2 25.35,41.46 25.48,41.59 U6.4
DP
  Top 0.203: U2.8 10.58,28.25 10.33,28 USB.D+
GND  (via drill 0.38)
  Top 0.254: 65.88,25.99 63.65,25.99 | 65.88,25.99 65.89,25.99 | U3.84 65.87,26 65.88,25.99 | 56.67,21.5 56.67,19.27 56.67,19.28 U3.62 | 60.17,21.46 60.17,19.23 60.17,19.24 U3.69 | 53.16,34.45 53.16,36.68 53.17,36.67 U3.21 | 65.94,33.99 63.71,33.99 | U3.31 50.5,31.5 51,31
  other vias: 30.5,2.5 37.88,29.12 47.38,20.25 45.88,18.75 44.5,26.38 16.62,7.75 14.12,16.62 14.12,18.88 11.1,20.72 5.77,20.74 16.83,23.31 16.23,21.82 13.93,21.63 5.77,27.78 5.72,24.02 10.59,25.25 10.76,27.33 10.38,43.26 12.77,43.3 65,55.12 82,55 45,55.12 19.75,44 8,1 21.25,32.75 23,28 23,25 20,22 22.12,18 27.12,23.75 56.62,21.88 29.25,32.12 31,29.88 32,32.75 35,43 21.5,39.5 18,34.12 10.38,14.38 60,21.88 33.88,25.5 72.12,28 51,31.38 43.25,34.12 61.75,42.38 66,49 71.5,39.38 71.62,37 72,34 78.36,37.98 64.2,35.17 66.89,34.64 43.12,51 47,47.25 27.88,39.25 66.38,26 66.97,27.03 38,25.75 38.12,32.88 54.12,12.62 38,23.38 89,28 89,48 24,32.25 28.25,30.38 26,55 12.12,34.25 35,7.88 37.12,50.12 1,48 8,55 89,8 73,18 82,1 67,18 69,7 1.75,20.65 1,28 11.62,39.38 1,8 8.38,12.62 11.71,12.58 56.93,18.53 8.22,20.73 4.7,26.81
  pour Bottom (isolate 0.254, rank 6): 0,0 90,0 90,56 0,56
  pour Top (isolate 0.254, rank 6): 0,0 90,0 90,56 0,56
N$1
  Top 0.203: U2.3 19.77,30.75 19.22,31.3 19.22,34.35 16.93,36.64 11.12,36.64 8.33,39.43 XTAL1.2 6.77,43.07 C9.1
N$2
  Top 0.203: U2.2 20.03,31.25 19.73,31.56 19.73,34.6 16.43,37.91 XTAL1.1 16.43,43.07 C10.1
N$3
  Top 0.203: U2.14 19.52,25.25 19.22,24.95 19.22,22.67 18.8,22.25 R2.2
N$4
  Top 0.203: U2.6 12.89,29.25 12.11,30.03 R1.2
N$5
  Top 0.381: USB.VUSB 6.09,29.6 3.73,27.24 3.73,25.46 4.74,24.44 4.74,20.38 6.27,18.86 8.39,18.86 U1.3 C15.2
N$6
  Top 0.381: R10.1 PWR.A
N$8
  Top 0.203: LED.A R9.1
N$12
  Top 0.254: RN2.8 72.18,32.09 76.98,36.89 JTAG.3
N$27
  Top 0.254: RN2.7 72.56,31.19 75.71,34.35 JTAG.5
N$28
  Top 0.254: RN2.6 73.28,30.39 74.7,31.81 JTAG.7
N$32
  Top 0.254: RN2.5 72.18,29.5 72.41,29.27 JTAG.9
N$33
  Top 0.254: RN3.8 73.96,25.23 75.46,26.73 JTAG.11
N$38
  Top 0.203: 79.88,24.34 JTAG.13
  Top 0.254: RN3.7 79.88,24.34
N$45
  Top 0.254: RN3.6 73.06,23.54 74.95,21.65 JTAG.15
N$52
  Top 0.254: RN3.5 72.69,22.64 76.22,19.11 JTAG.17
N$64
  Top 0.254: R3.2 73.43,20.63 77.49,16.57 JTAG.19
N$72  (via drill 0.38)
  Top 0.254: U4.6 U4.5 42.27,7.98 40.5,9.75 40.5,11 39.73,11.77 U4.12 | U4.12 U4.13 | U4.12 38.57,13.07 38.5,13 v38.5,11 | v35,47 R5.1
  Bottom 0.254: v38.5,11 38.75,11 38.88,11.12 38.88,29.12 39,29.25 39,43 v35,47 29.5,52.5 MODE.3
N$73
  Top 0.203: U5.12 U5.13 | U5.5 U5.6
  Top 0.254: U5.12 42.27,43.48 39.75,46 39.75,48.05 U5.5 | 38.5,51 38.5,48.11 U5.6 | 38.5,51 R4.2 | MODE.1 37,52.5 38.5,51
RTCK1
  Top 0.254: U3.81 66.88,24.5 67.61,25.23 RN3.1
SK
  Top 0.203: RN1.3 23.68,44.11 22.93,43.37 U6.2
  Top 0.254: U2.62 24.09,39.28 23,40.38 23,41.84 U6.2
TCK  (via drill 0.38)
  Top 0.254: U4.10 42.27,11.36 v43.75,9.88 | v48.25,23 U3.48
  Bottom 0.254: v43.75,9.88 44.5,10.62 44.5,18.62 48.25,22.38 v48.25,23
TCK1
  Top 0.203: RN2.4 68.83,29.5 68.58,29.5
  Top 0.254: U3.91 68.58,29.5
TDI  (via drill 0.38)
  Top 0.254: U4.9 43.54,11.21 v43.75,11 | U3.45 48.62,24.5 v48.38,24.25
  Bottom 0.254: v43.75,11 43.75,18.62 47.62,22.5 47.62,23.5 v48.38,24.25
TDI1
  Top 0.254: U3.94 67.03,31 67.22,31.19 RN2.2
TDO  (via drill 0.38)
  Top 0.254: U3.83 58.23,25.5 v58.19,25.46 | U4.3 39.73,5.14 v39.75,5.12
  Bottom 0.254: v39.75,5.12 40,5.12 45,10.12 45,14 56.46,25.46 v58.19,25.46
TDO1
  Top 0.254: U3.79 66.89,23.5 67.73,24.34 RN3.2
TMS  (via drill 0.38)
  Top 0.254: U4.2 38.46,5.17 v38.5,5.12 | U3.47 48.75,23.5 48.62,23.62 47.75,23.62 v47,22.88
  Bottom 0.254: v38.5,5.12 38.5,7.5 40,9 42,9 43,10 43,18.88 v47,22.88
TMS1
  Top 0.254: U3.92 67.04,30 67.44,30.39 RN2.3
TRST1
  Top 0.254: U3.97 66.89,32.5 67.31,32.09 RN2.1
TSRST1
  Top 0.254: U3.78 67.41,23 67.95,23.54 RN3.3
VPHY
  Top 0.254: U2.4 19.51,30.25 18.8,30.96 C13.2 16.28,30.96 C11.+ 16.06,30.96 L2.1
VPLL
  Top 0.254: U2.9 16.68,27.75 16.17,27.24 C14.2 14.25,26.31 C12.+ 14.03,26.31 L1.1
VT  (via drill 0.38)
  Top 0.254: C24.2 67.84,34.1 66.74,33 U3.98 | C25.1 U3.88
  Top 0.381: R7.1 66.97,41.76 D1.C 66.97,37.02 C22.+ | C22.+ 67.1,35.85 67.58,35.37 68.6,35.37 69.02,34.95 C24.2 | v65.55,36.89 C22.+
  Top 0.406: v17.62,2 R8.2 | C25.1 69.02,26.86 69.25,26.62 v69.88,26.62
  Bottom 0.381: v65.55,36.89 67.33,36.89 68.61,35.61
  Bottom 0.406: v17.62,2 18.6,1.02 72.65,1.02 73.38,1.75 73.38,15.49 69.88,19 v69.88,26.62 69.88,34.34 68.61,35.61
VTG
  Top 0.381: JTAG.2 JTAG.1 76.22,39.43 73.68,41.97 R7.2 69.87,42.12
  Top 0.406: JTAG.2 82.57,47.7 JP4.2
  Bottom 0.406: JP1.1 77.24,5.5 77.24,38.99 77.68,39.43 JTAG.1

### Text on the board
tPlace: Ian Lesnet | I+S 2012 | v.trocio
tNames: P13 | P12 | P11 | P10 | P9 | P8 | P7 | P6 | P4 | P3 | P2 | P1 | GND | Target power | VTG | VTG | TRST | TDI | TMS | TCK | GND | RTCK | TDO | TSRST | DBGRQ | DBGACK | Bus Blaster v4.1a | Dangerous Prototypes | P61 | P64 | P67 | P68 | P70 | P71 | P72 | P74 | P89 | P90 | P99 | GND | VTG
bNames: JP2 | P13 | P12 | P11 | P10 | P9 | P8 | P7 | P6 | P4 | P3 | P2 | P1 | GND | VTG | Bus Blaster v4.1a | VTG | Dangerous Prototypes | TRST | TDI | JUL 2012 | TMS | TCK | GND | RTCK | Fulfillment By: | TDO | Seeed Studio | TSRST | www.seeedstudio.com | DBGRQ | DBGACK | JTAG | P61 | P64 | P67 | P68 | P70 | P71 | P72 | P74 | P89 | P90 | P99 | GND | VTG | JP1